# EAGLE design OR Mod PCB v002 (EAGLE 8.1.1)
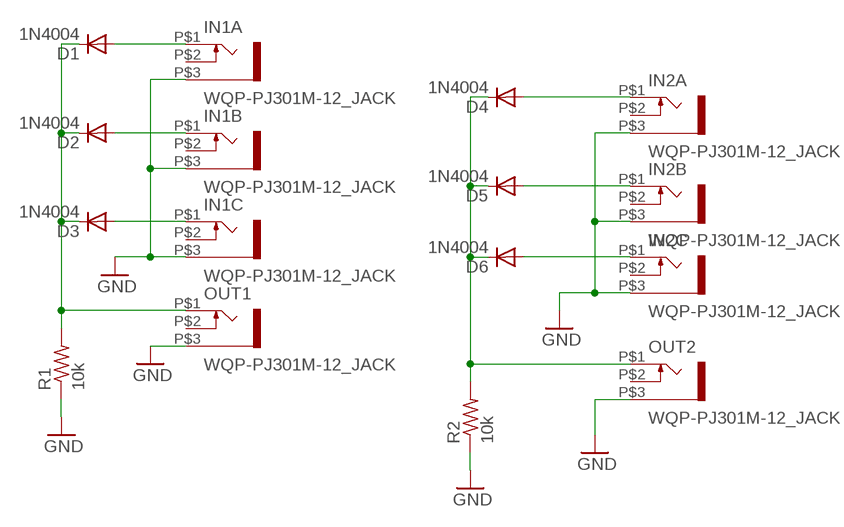
[diagram p0: schematic, sheet 1]

## Parts
D1  1N4004  [DO41-10]
D2  1N4004  [DO41-10]
D3  1N4004  [DO41-10]
D4  1N4004  [DO41-10]
D5  1N4004  [DO41-10]
D6  1N4004  [DO41-10]
IN1A  WQP-PJ301M-12_JACK  [WQP-PJ301M-12_JACK]
IN1B  WQP-PJ301M-12_JACK  [WQP-PJ301M-12_JACK]
IN1C  WQP-PJ301M-12_JACK  [WQP-PJ301M-12_JACK]
IN2A  WQP-PJ301M-12_JACK  [WQP-PJ301M-12_JACK]
IN2B  WQP-PJ301M-12_JACK  [WQP-PJ301M-12_JACK]
IN2C  WQP-PJ301M-12_JACK  [WQP-PJ301M-12_JACK]
OUT1  WQP-PJ301M-12_JACK  [WQP-PJ301M-12_JACK]
OUT2  WQP-PJ301M-12_JACK  [WQP-PJ301M-12_JACK]
R1  10k  R-US_0204/7  [0204/7]
R2  10k  R-US_0204/7  [0204/7]

## Nets
GND: IN1A.P$3 IN1B.P$3 IN1C.P$3 IN2A.P$3 IN2B.P$3 IN2C.P$3 OUT1.P$3 OUT2.P$3 R1.1 R2.1
N$1: D1.C D2.C D3.C OUT1.P$1 R1.2
N$2: D4.A IN2A.P$1
N$3: D6.A IN2C.P$1
N$5: D1.A IN1A.P$1
N$6: D2.A IN1B.P$1
N$7: D3.A IN1C.P$1
N$8: D5.A IN2B.P$1
N$10: D4.C D5.C D6.C OUT2.P$1 R2.2
Unconnected: IN1A.P$2 IN1B.P$2 IN1C.P$2 IN2A.P$2 IN2B.P$2 IN2C.P$2 OUT1.P$2 OUT2.P$2

## Library data of the parts
D1-D6 = adafruit:1N4004: DIODE General purpose 1N400x type rectifier (With bigger pads) http://www.ladyada.net/library/pcb/eaglelibrary.html
IN1A IN1B IN1C IN2A IN2B IN2C OUT1 OUT2 = thonkiconn:WQP-PJ301M-12_JACK
R1 R2 = adafruit:R-US_: RESISTOR, American symbol

## Board
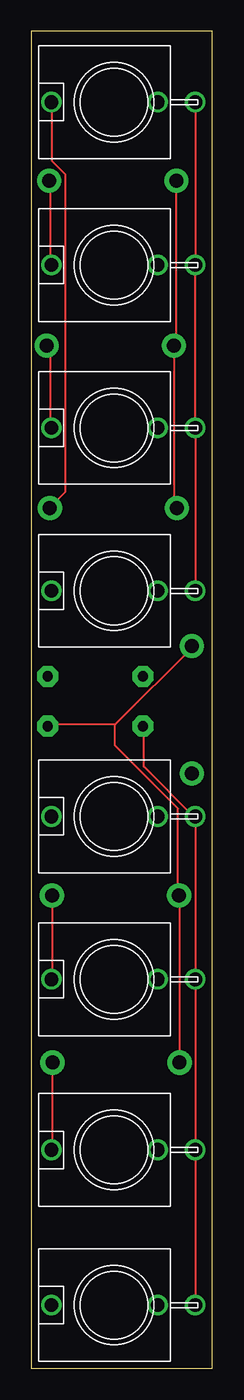
[diagram p1: board, top side]
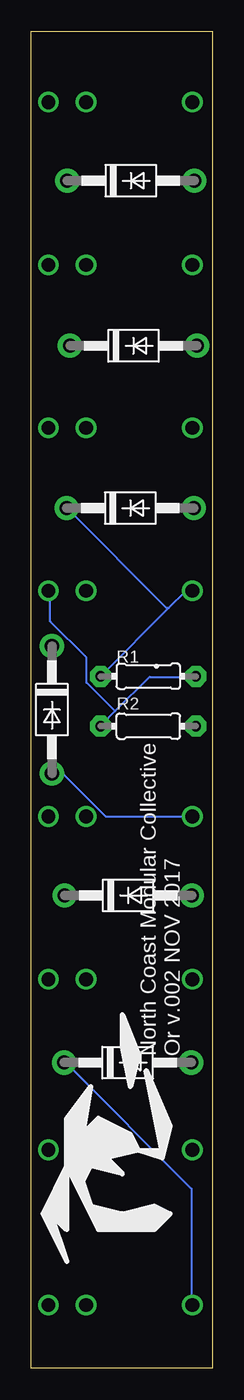
[diagram p2: board, bottom side, seen from below]

Size 14.48 x 106.68 mm. Coordinates in mm from the lower left corner, seen from the top.
Outline: 0,0 14.48,0 14.48,106.68 0,106.68 0,0
Copper layers (1*16): Top 0.035mm / dielectric 1.5mm / Bottom 0.035mm
Design rules "Smart Prototyping - NOA Eagle Rule 2016-06-12": minimum track width 6mil, minimum drill 0.3mm, track to track 6mil, track to pad 6mil, pad to pad 6mil, via to via 6mil, smd to smd 0mil, copper to edge 0.4mm, drill to drill 10mil, minimum pad ring 10mil, minimum via ring 6mil, stop-mask expansion 2mil, vias tented up to drill 25mil, thermal gap 10mil

### Footprints (pad centres in the part's own frame; a part is rotated, then mirrored left to right if it is on the bottom)
DO41-10 = drill 1.118 pad 1.93: A 5.08,0; C -5.08,0
WQP-PJ301M-12_JACK = drill 1.1: P$1 0,5; P$2 0,-3.5; P$3 0,-6.5
0204/7 = drill 0.813 pad 1.676 octagon: 1 -3.81,0; 2 3.81,0

### Placement (x,y rotation side)
D1  6.56,68.64 0 bottom
D2  6.52,94.76 0 bottom
D3  6.31,81.59 0 bottom
D4  12.83,52.55 270 bottom
D5  6.73,37.73 0 bottom
D6  6.77,24.39 0 bottom
IN1A  6.6,101.03 90 top
IN1B  6.6,88.03 90 top
IN1C  6.6,75.03 90 top
IN2A  6.6,44.03 90 top
IN2B  6.6,31.03 90 top
IN2C  6.6,17.42 90 top
OUT1  6.6,62.03 90 top
OUT2  6.6,5.03 90 top
R1  5.12,55.21 180 bottom
R2  5.12,51.23 0 bottom

### Tracks (layer width: path | path; a pad name or v marks a point on that pad's centre or on a via)
GND
  Top 0.152: IN1A.P$3 13.11,100.89 13.11,88.09 IN1B.P$3 13.11,87.94 13.11,75.13 IN1C.P$3 13.11,74.98 13.11,62.18 OUT1.P$3 | OUT2.P$3 13.11,5.18 13.11,17.37 IN2C.P$3 13.11,17.53 13.11,30.94 IN2B.P$3 13.11,31.09 13.11,43.89 IN2A.P$3 12.95,44.04 8.99,48.01 8.99,51.21 R2.1
  Bottom 0.152: 7.77,52.43 8.84,51.36 R2.1 | 7.77,52.43 5.03,55.17 1.37,55.17 R1.1 | 7.77,52.43 10.06,54.71 10.06,56.69 12.95,59.59 12.95,62.03 OUT1.P$3
N$1
  Top 0.152: D1.C 11.58,68.73 11.43,68.89 11.43,81.53 D3.C 11.43,81.69 11.58,81.84 11.58,94.64 D2.C
  Bottom 0.152: 3.5,60.66 8.84,55.32 R1.2 | 3.5,60.66 2.13,62.03 1.68,62.03 OUT1.P$1 | 3.5,60.66 3.66,60.66 11.58,68.58 D1.C
N$2
  Bottom 0.152: IN2A.P$1 1.68,44.04 8.53,44.04 11.89,47.4 12.8,47.4 D4.A
N$3
  Top 0.152: IN2C.P$1 1.68,17.53 1.68,24.38 D6.A
N$5
  Top 0.152: IN1A.P$1 1.68,100.89 1.68,96.32 2.74,95.25 2.74,69.95 1.52,68.73 D1.A
N$6
  Top 0.152: IN1B.P$1 1.52,88.09 1.52,94.64 D2.A
N$7
  Top 0.152: IN1C.P$1 1.52,75.13 1.52,81.38 1.37,81.53 D3.A
N$8
  Top 0.152: IN2B.P$1 1.68,31.09 1.68,37.64 D5.A
N$10
  Top 0.152: 6.71,51.36 1.37,51.36 R2.2 | 6.71,51.36 12.95,57.61 D4.C | D6.C 11.89,24.54 11.89,37.64 D5.C 11.73,37.8 11.73,44.65 6.71,49.68 6.71,51.36
  Bottom 0.152: OUT2.P$1 1.68,5.18 1.68,14.33 11.73,24.38 D6.C

### Text on the board
bNames: North Coast Modular Collective / Or v.002 NOV 2017